# EAGLE schematic tritiled2x_programmer (EAGLE 7.3.0)
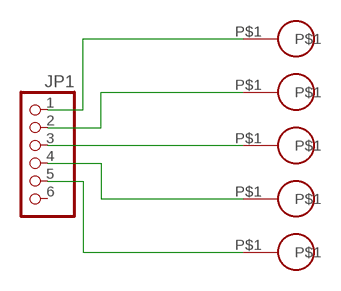
[diagram p0: schematic, sheet 1]

## Parts
JP1  PINHD-1X6  [1X06]
U$1  SPRING_PIN  [SPRING_PIN]
U$2  SPRING_PIN  [SPRING_PIN]
U$3  SPRING_PIN  [SPRING_PIN]
U$4  SPRING_PIN  [SPRING_PIN]
U$5  SPRING_PIN  [SPRING_PIN]

## Nets
ICSPCLK: JP1.5 U$5.P$1
ICSPDAT: JP1.4 U$4.P$1
VDD: JP1.2 U$2.P$1
VPP: JP1.1 U$1.P$1
VSS: JP1.3 U$3.P$1
Unconnected: JP1.6

## Library data of the parts
JP1 = z0:PINHD-1X6: PIN HEADER
U$1-U$5 = led_temp:SPRING_PIN